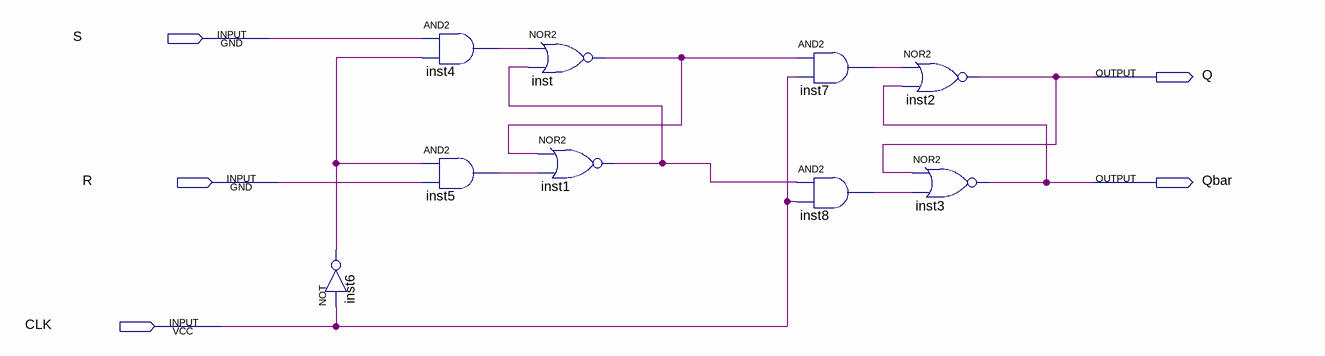
[diagram p0: schematic sheet]
// Quartus schematic SR_FlipFlop.bdf as structural Verilog: 9 symbols, 5 pins
module SR_FlipFlop (
  input  S,
  input  R,
  input  CLK,
  output Q,
  output Qbar
);

  wire inst1_out, inst4_out, inst5_out, inst6_out, inst7_out, inst8_out, inst_out;

  not inst6 (inst6_out, CLK);
  and inst4 (inst4_out, S, inst6_out);
  and inst5 (inst5_out, inst6_out, R);
  nor inst (inst_out, inst4_out, inst1_out);
  nor inst1 (inst1_out, inst_out, inst5_out);
  and inst7 (inst7_out, inst_out, CLK);
  and inst8 (inst8_out, inst1_out, CLK);
  nor inst2 (Q, inst7_out, Qbar);
  nor inst3 (Qbar, Q, inst8_out);
endmodule
